# EAGLE design Chip Apple Power (EAGLE 7.7.0)
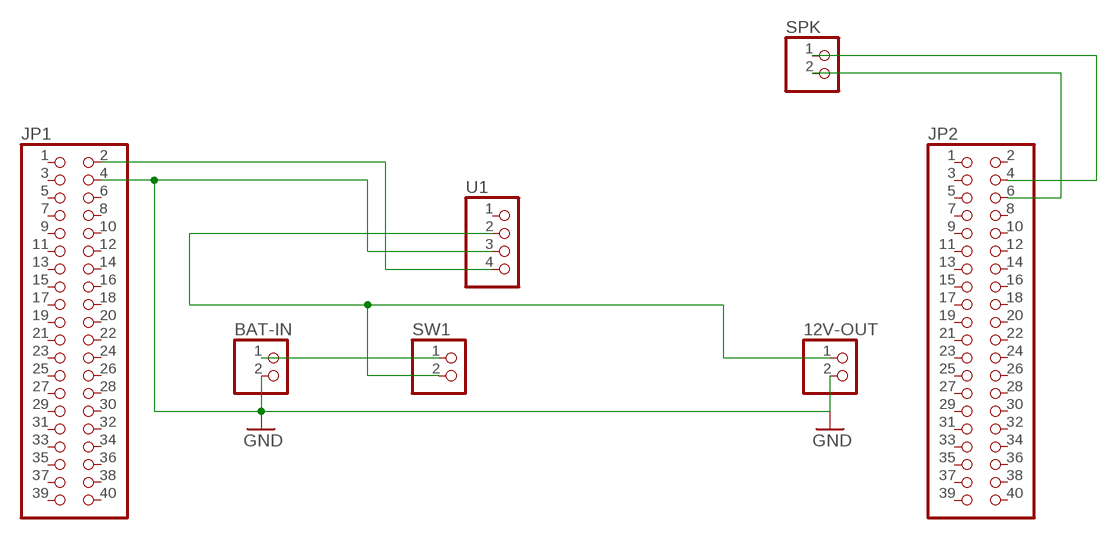
[diagram p0: schematic, sheet 1]

## Parts
12V-OUT  PINHD-1X2  [1X02]
BAT-IN  PINHD-1X2  [1X02]
JP1  PINHD-2X20  [2X20]
JP2  PINHD-2X20  [2X20]
SPK  PINHD-1X2  [1X02]
SW1  PINHD-1X2  [1X02]
U1  PINHD-1X4/90  [1X04/90]

## Nets
GND: 12V-OUT.2 BAT-IN.2 JP1.4 U1.3
N$1: BAT-IN.1 SW1.1
N$3: 12V-OUT.1 SW1.2 U1.2
N$4: JP2.4 SPK.1
N$7: JP2.6 SPK.2
U1: JP1.2 U1.4
Unconnected: JP1.1 JP1.3 JP1.5 JP1.6 JP1.7 JP1.8 JP1.9 JP1.10 JP1.11 JP1.12 JP1.13 JP1.14 JP1.15 JP1.16 JP1.17 JP1.18 JP1.19 JP1.20 JP1.21 JP1.22 JP1.23 JP1.24 JP1.25 JP1.26 JP1.27 JP1.28 JP1.29 JP1.30 JP1.31 JP1.32 JP1.33 JP1.34 JP1.35 JP1.36 JP1.37 JP1.38 JP1.39 JP1.40 JP2.1 JP2.2 JP2.3 JP2.5 JP2.7 JP2.8 JP2.9 JP2.10 JP2.11 JP2.12 JP2.13 JP2.14 JP2.15 JP2.16 JP2.17 JP2.18 JP2.19 JP2.20 JP2.21 JP2.22 JP2.23 JP2.24 JP2.25 JP2.26 JP2.27 JP2.28 JP2.29 JP2.30 JP2.31 JP2.32 JP2.33 JP2.34 JP2.35 JP2.36 JP2.37 JP2.38 JP2.39 JP2.40 U1.1

## Library data of the parts
12V-OUT BAT-IN SPK SW1 = pinhead:PINHD-1X2: PIN HEADER
JP1 JP2 = pinhead:PINHD-2X20: PIN HEADER
U1 = pinhead:PINHD-1X4: PIN HEADER

## Board
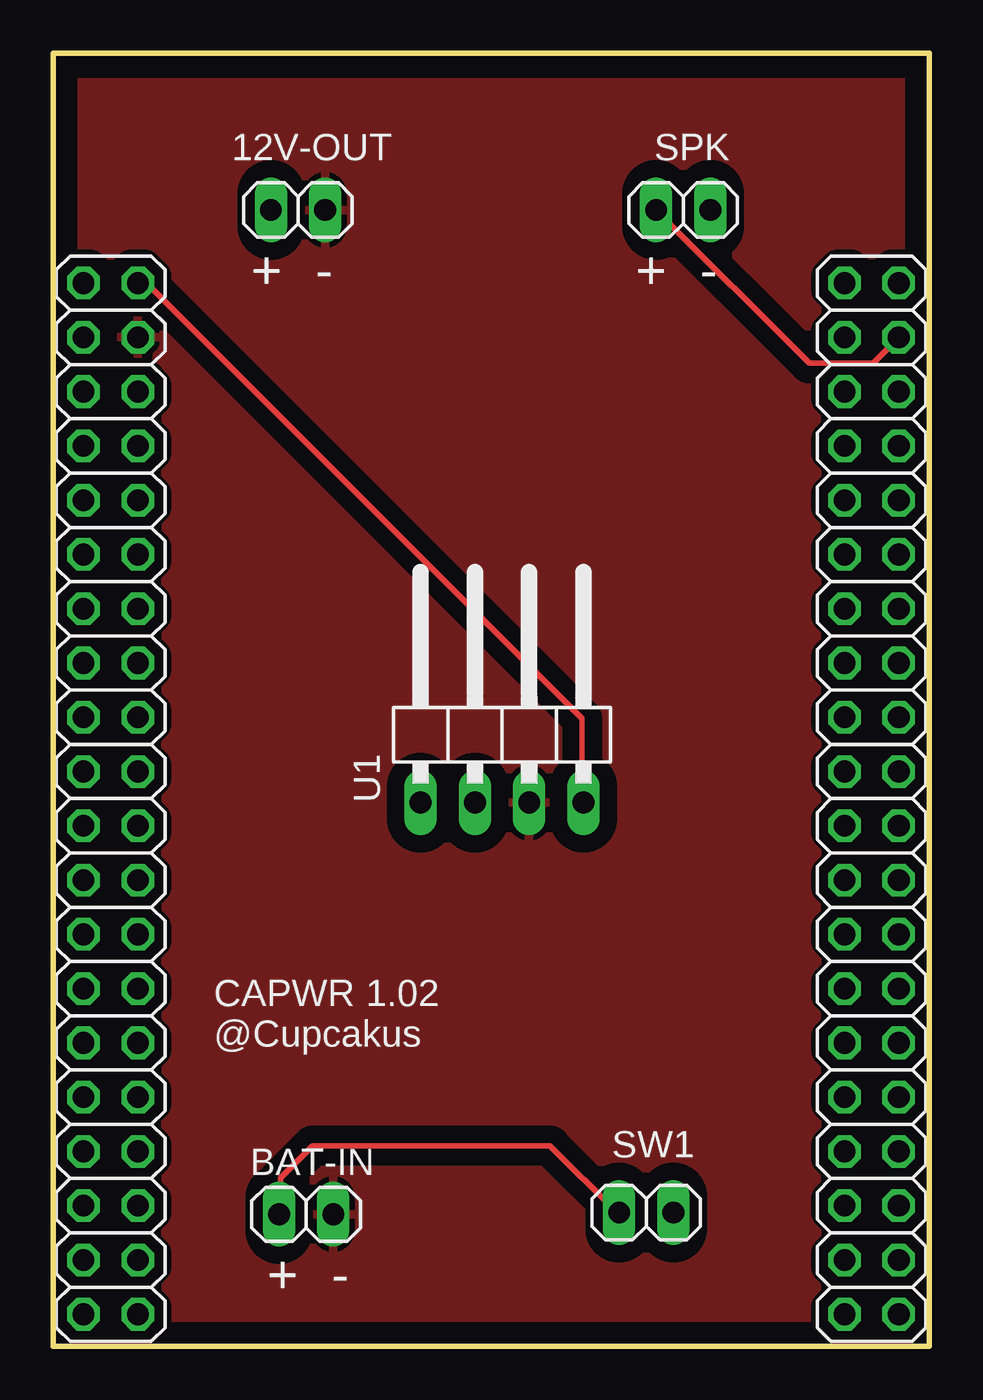
[diagram p1: board, top side]
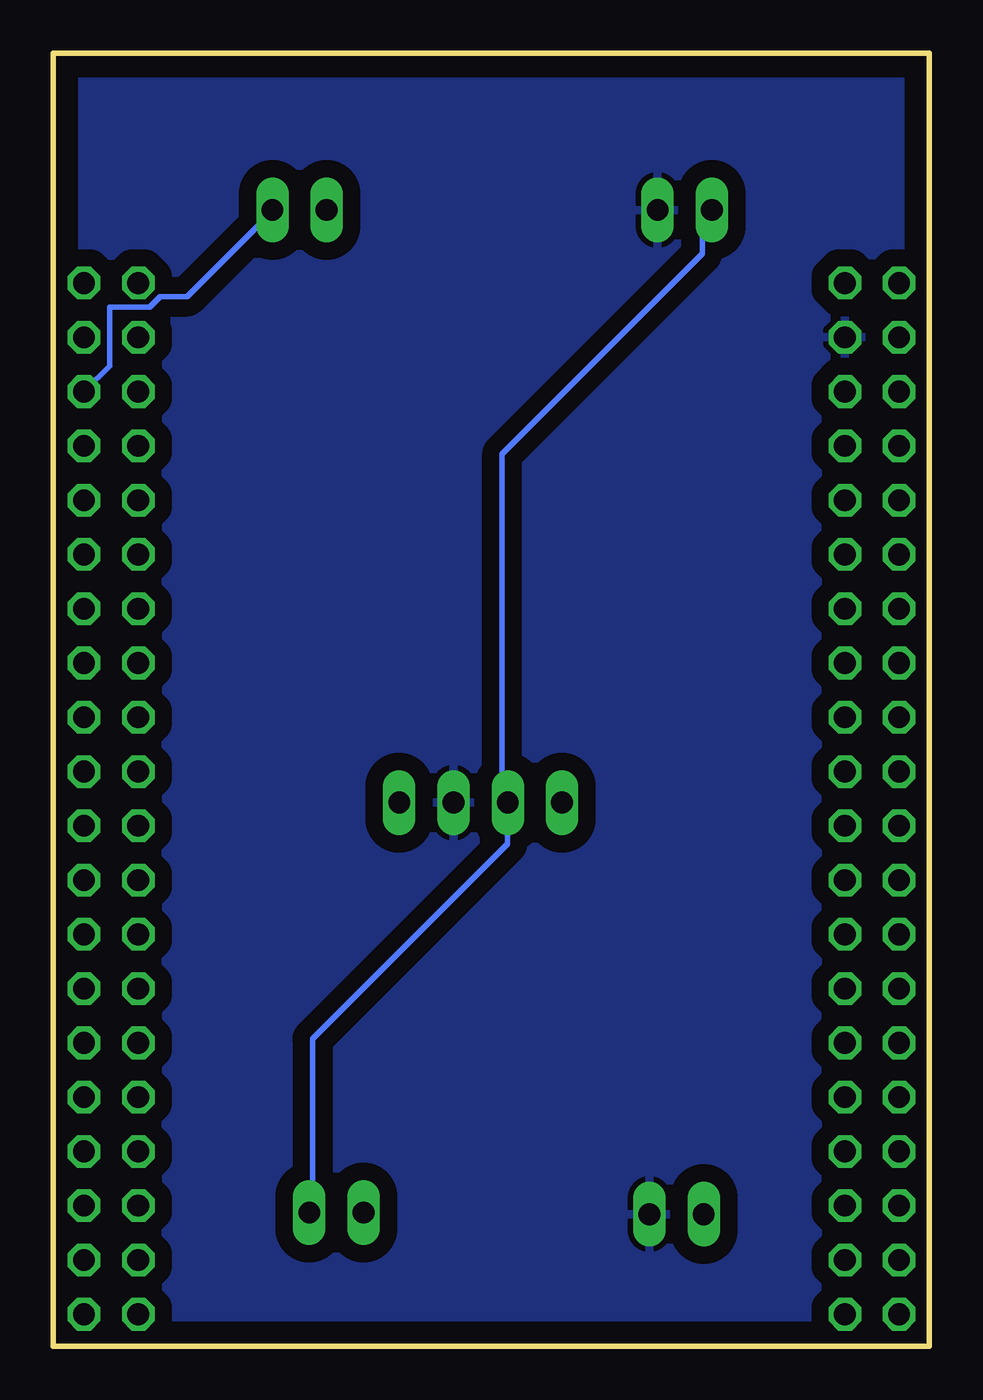
[diagram p2: board, bottom side, seen from below]

Size 41 x 60.5 mm. Coordinates in mm from the lower left corner, seen from the top.
Outline: 0,0 41,0 41,60.5 0,60.5 0,0
Copper layers (1*16): Top 0.035mm / dielectric 1.5mm / Bottom 0.035mm
Design rules "default": minimum track width 10mil, minimum drill 24mil, track to track 8mil, track to pad 8mil, pad to pad 8mil, via to via 8mil, smd to smd 8mil, copper to edge 40mil, drill to drill 8mil, minimum pad ring 10mil, minimum via ring 8mil, stop-mask expansion 4mil, vias tented up to drill 0mil, thermal gap 10mil

### Footprints (pad centres in the part's own frame; a part is rotated, then mirrored left to right if it is on the bottom)
1X02 = drill 1.016 long: 1 -1.27,0; 2 1.27,0
2X20 = drill 1.016 octagon: 1 -24.13,-1.27; 2 -24.13,1.27; 3 -21.59,-1.27; 4 -21.59,1.27; 5 -19.05,-1.27; 6 -19.05,1.27; 7 -16.51,-1.27; 8 -16.51,1.27; 9 -13.97,-1.27; 10 -13.97,1.27; 11 -11.43,-1.27; 12 -11.43,1.27; 13 -8.89,-1.27; 14 -8.89,1.27; 15 -6.35,-1.27; 16 -6.35,1.27; 17 -3.81,-1.27; 18 -3.81,1.27; 19 -1.27,-1.27; 20 -1.27,1.27; 21 1.27,-1.27; 22 1.27,1.27; 23 3.81,-1.27; 24 3.81,1.27; 25 6.35,-1.27; 26 6.35,1.27; 27 8.89,-1.27; 28 8.89,1.27; 29 11.43,-1.27; 30 11.43,1.27; 31 13.97,-1.27; 32 13.97,1.27; 33 16.51,-1.27; 34 16.51,1.27; 35 19.05,-1.27; 36 19.05,1.27; 37 21.59,-1.27; 38 21.59,1.27; 39 24.13,-1.27; 40 24.13,1.27
1X04/90 = drill 1.016 long: 1 -3.81,-3.81; 2 -1.27,-3.81; 3 1.27,-3.81; 4 3.81,-3.81

### Placement (x,y rotation side)
12V-OUT  11.45,53.17 0 top
BAT-IN  11.83,6.17 0 top
JP1  2.68,25.62 270 top
JP2  38.3,25.62 270 top
SPK  29.48,53.17 0 top
SW1  27.75,6.25 0 top
U1  21,29.25 0 top

### Tracks (layer width: path | path; a pad name or v marks a point on that pad's centre or on a via)
GND
  pour Top (isolate 0.813): 0,60.5 0,0 41,0 41,60.5
  pour Bottom (isolate 0.813): 0,60.5 0,0 41,0 41,60.5
N$1
  Top 0.254: BAT-IN.1 10.62,6.25 10.62,7.88 12.12,9.38 23.25,9.38 26.38,6.25 SW1.1
N$3
  Bottom 0.254: SW1.2 29,6.25 28.88,6.38 28.88,14.38 19.75,23.5 19.75,25.38 U1.2 19.75,25.5 20,25.75 20,41.75 10.62,51.12 10.62,52.75 10.25,53.12 12V-OUT.1
N$4
  Top 0.254: SPK.1 28.25,53.12 35.38,46 38.38,46 39.5,47.12 JP2.4
N$7
  Bottom 0.254: SPK.2 30.75,53.12 34.75,49.12 36,49.12 36.5,48.62 38.38,48.62 38.38,45.88 39.5,44.75 JP2.6
U1
  Top 0.254: JP1.2 4.38,49.75 24.75,29.38 24.75,25.5 U1.4

### Text on the board
tNames: + | - | + | - | CAPWR 1.02 / @Cupcakus | + | -